# EAGLE design PosilaciSystemy (EAGLE 5.06)
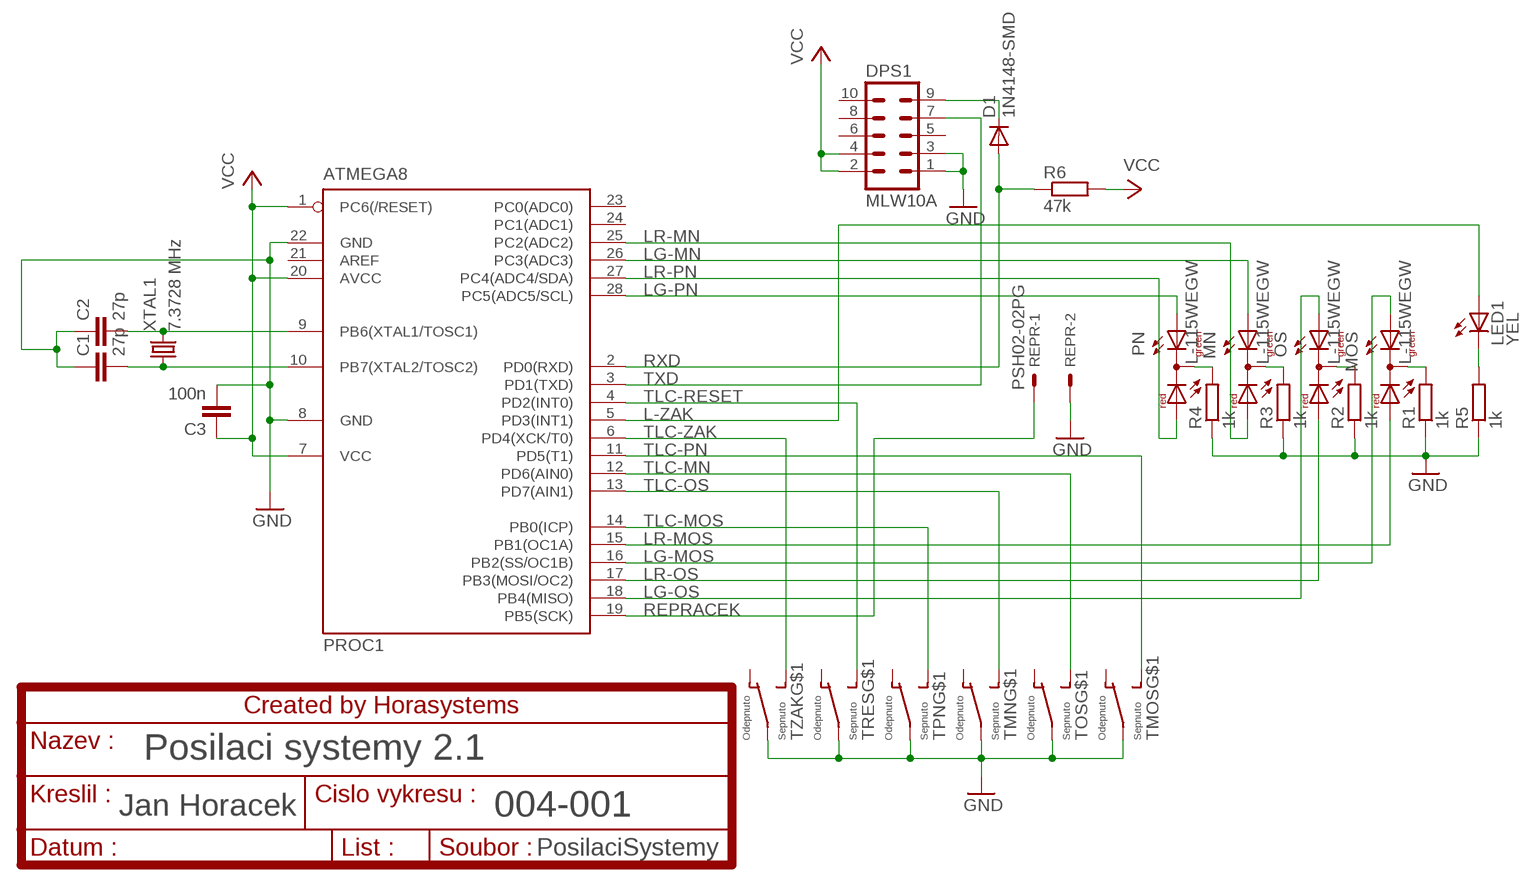
[diagram p0: schematic, sheet 1]

## Parts
C1  27p  C-EUC0805  [C0805]
C2  27p  C-EUC0805  [C0805]
C3  100n  C-EUC1206  [C1206]
D1  1N4148-SMD  1N4148-1206  [R1206]
DPS1  MLW10A  ML10L  [ML10L]
LED1  YEL  LED3MM  [LED3MM]
MN  L-115WEGW  DUOLED-RG-C  [DUOLED-C-5MM]
MOS  L-115WEGW  DUOLED-RG-C  [DUOLED-C-5MM]
OS  L-115WEGW  DUOLED-RG-C  [DUOLED-C-5MM]
PN  L-115WEGW  DUOLED-RG-C  [DUOLED-C-5MM]
PROC1  ATMEGA8  MEGA8-P  [DIL28-3]
R1  1k  R-EU_R1206  [R1206]
R2  1k  R-EU_R1206  [R1206]
R3  1k  R-EU_R1206  [R1206]
R4  1k  R-EU_R1206  [R1206]
R5  1k  R-EU_R1206  [R1206]
R6  47k  R-EU_R1206  [R1206]
REPR  PSH02-02PG  22-05-7028-02  [7395-02]
TMN  P-B170H  HORASPINAC  [HORASPINAC]
TMOS  P-B170H  HORASPINAC  [HORASPINAC]
TOS  P-B170H  HORASPINAC  [HORASPINAC]
TPN  P-B170H  HORASPINAC  [HORASPINAC]
TRES  P-B170H  HORASPINAC  [HORASPINAC]
TZAK  P-B170H  HORASPINAC  [HORASPINAC]
XTAL1  7.3728 MHz  CRYSTALHC49S  [HC49/S]

## Nets
GND: C1.1 C2.1 C3.2 DPS1.1 DPS1.3 PROC1.8(GND) PROC1.22(GND) R1.1 R2.1 R3.1 R4.1 R5.1 REPR.2 TMN.NAPAJENI1(NAPAJENI) TMOS.NAPAJENI1(NAPAJENI) TOS.NAPAJENI1(NAPAJENI) TPN.NAPAJENI1(NAPAJENI) TRES.NAPAJENI1(NAPAJENI) TZAK.NAPAJENI1(NAPAJENI)
L1: MOS.C R1.2
L2: OS.C R2.2
L3: MN.C R3.2
L4: PN.C R4.2
L-ZAK: LED1.A PROC1.5(PD3(INT1))
LG-MN: MN.AX(AG) PROC1.26(PC3(ADC3))
LG-MOS: MOS.AX(AG) PROC1.16(PB2(SS/OC1B))
LG-OS: OS.AX(AG) PROC1.18(PB4(MISO))
LG-PN: PN.AX(AG) PROC1.28(PC5(ADC5/SCL))
LR-MN: MN.AR PROC1.25(PC2(ADC2))
LR-MOS: MOS.AR PROC1.15(PB1(OC1A))
LR-OS: OS.AR PROC1.17(PB3(MOSI/OC2))
LR-PN: PN.AR PROC1.27(PC4(ADC4/SDA))
N$5: LED1.K(C) R5.2
REPRACEK: PROC1.19(PB5(SCK)) REPR.1
RXD: D1.A PROC1.2(PD0(RXD)) R6.1
RXD_: D1.K(C) DPS1.9
TLC-MN: PROC1.12(PD6(AIN0)) TOS.SEPNUTO1(SEPNUTO)
TLC-MOS: PROC1.14(PB0(ICP)) TPN.SEPNUTO1(SEPNUTO)
TLC-OS: PROC1.13(PD7(AIN1)) TMN.SEPNUTO1(SEPNUTO)
TLC-PN: PROC1.11(PD5(T1)) TMOS.SEPNUTO1(SEPNUTO)
TLC-RESET: PROC1.4(PD2(INT0)) TRES.SEPNUTO1(SEPNUTO)
TLC-ZAK: PROC1.6(PD4(XCK/T0)) TZAK.SEPNUTO1(SEPNUTO)
TXD: DPS1.7 PROC1.3(PD1(TXD))
VCC: C3.1 DPS1.2 DPS1.4 PROC1.1(PC6(/RESET)) PROC1.7(VCC) PROC1.20(AVCC) R6.2
XTAL1: C2.2 PROC1.9(PB6(XTAL1/TOSC1)) XTAL1.2
XTAL2: C1.2 PROC1.10(PB7(XTAL2/TOSC2)) XTAL1.1
Unconnected: DPS1.5 DPS1.6 DPS1.8 DPS1.10 PROC1.21(AREF) PROC1.23(PC0(ADC0)) PROC1.24(PC1(ADC1)) TMN.NAPAJENI2(NAPAJENI) TMN.ODEPNUTO1(ODEPNUTO) TMN.ODEPNUTO2(ODEPNUTO) TMN.SEPNUTO2(SEPNUTO) TMOS.NAPAJENI2(NAPAJENI) TMOS.ODEPNUTO1(ODEPNUTO) TMOS.ODEPNUTO2(ODEPNUTO) TMOS.SEPNUTO2(SEPNUTO) TOS.NAPAJENI2(NAPAJENI) TOS.ODEPNUTO1(ODEPNUTO) TOS.ODEPNUTO2(ODEPNUTO) TOS.SEPNUTO2(SEPNUTO) TPN.NAPAJENI2(NAPAJENI) TPN.ODEPNUTO1(ODEPNUTO) TPN.ODEPNUTO2(ODEPNUTO) TPN.SEPNUTO2(SEPNUTO) TRES.NAPAJENI2(NAPAJENI) TRES.ODEPNUTO1(ODEPNUTO) TRES.ODEPNUTO2(ODEPNUTO) TRES.SEPNUTO2(SEPNUTO) TZAK.NAPAJENI2(NAPAJENI) TZAK.ODEPNUTO1(ODEPNUTO) TZAK.ODEPNUTO2(ODEPNUTO) TZAK.SEPNUTO2(SEPNUTO)

## Notes on the sheet
- Posilaci systemy 2.1
- 004-001

## Library data of the parts
C1-C3 = rcl:C-EU: CAPACITOR, European symbol
D1 = diode:1N4148: DIODE high speed (Philips)
DPS1 = con-ml:ML10L: HARTING
LED1 = led:LED: LED OSRAM: - CHIPLED LG R971, LG N971, LY N971, LG Q971, LY Q971, LO R971, LY R971 LH N974, LH R974 LS Q976, LO Q976, LY Q976 LO Q996 - Hyper CHIPLED LW Q18S LB Q993, LB Q99A, LB R99A - SideLED LS A670, LO A670, LY A670, LG A670, LP A670 LB A673, LV A673, LT A673, LW A673 LH A674 LY A675 LS A676, LA A676, LO A676, LY A676, LW A676 LS A679, LY A679, LG A679 - Hyper Micro SIDELED® LS Y876, LA Y876, LO Y876, LY Y876 LT Y87S - SmartLED LW L88C, LW L88S LB L89C, LB L89S, LG L890 LS L89K, LO L89K, LY L89K LS L896, LA L896, LO L896, LY L896 - TOPLED LS T670, LO T670, LY T670, LG T670, LP T670 LSG T670, LSP T670, LSY T670, LOP T670, LYG T670 LG T671, LOG T671, LSG T671 LB T673, LV T673, LT T673, LW T673 LH T674 LS T676, LA T676, LO T676, LY T676, LB T676, LH T676, LSB T676, LW T676 LB T67C, LV T67C, LT T67C, LS T67K, LO T67K, LY T67K, LW E67C LS E67B, LA E67B, LO E67B, LY E67B, LB E67C, LV E67C, LT E67C LW T67C LS T679, LY T679, LG T679 LS T770, LO T770, LY T770, LG T770, LP T770 LB T773, LV T773, LT T773, LW T773 LH T774 LS E675, LA E675, LY E675, LS T675 LS T776, LA T776, LO T776, LY T776, LB T776 LHGB T686 LT T68C, LB T68C - Hyper Mini TOPLED® LB M676 - Mini TOPLED Santana® LG M470 LS M47K, LO M47K, LY M47K Source: http://www.osram.convergy.de LUXEON: - LUMILED® LXK2-PW12-R00, LXK2-PW12-S00, LXK2-PW14-U00, LXK2-PW14-V00 LXK2-PM12-R00, LXK2-PM12-S00, LXK2-PM14-U00 LXK2-PE12-Q00, LXK2-PE12-R00, LXK2-PE12-S00, LXK2-PE14-T00, LXK2-PE14-U00 LXK2-PB12-K00, LXK2-PB12-L00, LXK2-PB12-M00, LXK2-PB14-N00, LXK2-PB14-P00, LXK2-PB14-Q00 LXK2-PR12-L00, LXK2-PR12-M00, LXK2-PR14-Q00, LXK2-PR14-R00 LXK2-PD12-Q00, LXK2-PD12-R00, LXK2-PD12-S00 LXK2-PH12-R00, LXK2-PH12-S00 LXK2-PL12-P00, LXK2-PL12-Q00, LXK2-PL12-R00 Source: www.luxeon.com KINGBRIGHT: KA-3528ASYC Source: www.kingbright.com
MN MOS OS PN = led:DUOLED-RG-C: DUO LED 2 colors (red/green), 5 mm, round, common Cathode www.ligitek.com or other producers.
PROC1 = atmel:MEGA8-P: MICROCONTROLLER 8 Kbytes FLASH, 1 kbytes SRAM, 512 bytes EEPROM, USART, 4-channel 10 bit ADC, 2-channel 8 bit ADC Pin compatible with Atmega48, ATMega88, ATMega168 Source: avr.lbr
R1-R6 = rcl:R-EU_: RESISTOR, European symbol
REPR = con-molex:22-?-02: CONNECTOR wire to board 2.54 mm (.1 inch) pitch header
TMN TMOS TOS TPN TRES TZAK = switch:HORASPINAC
XTAL1 = crystal:CRYSTAL: CRYSTAL

## Board
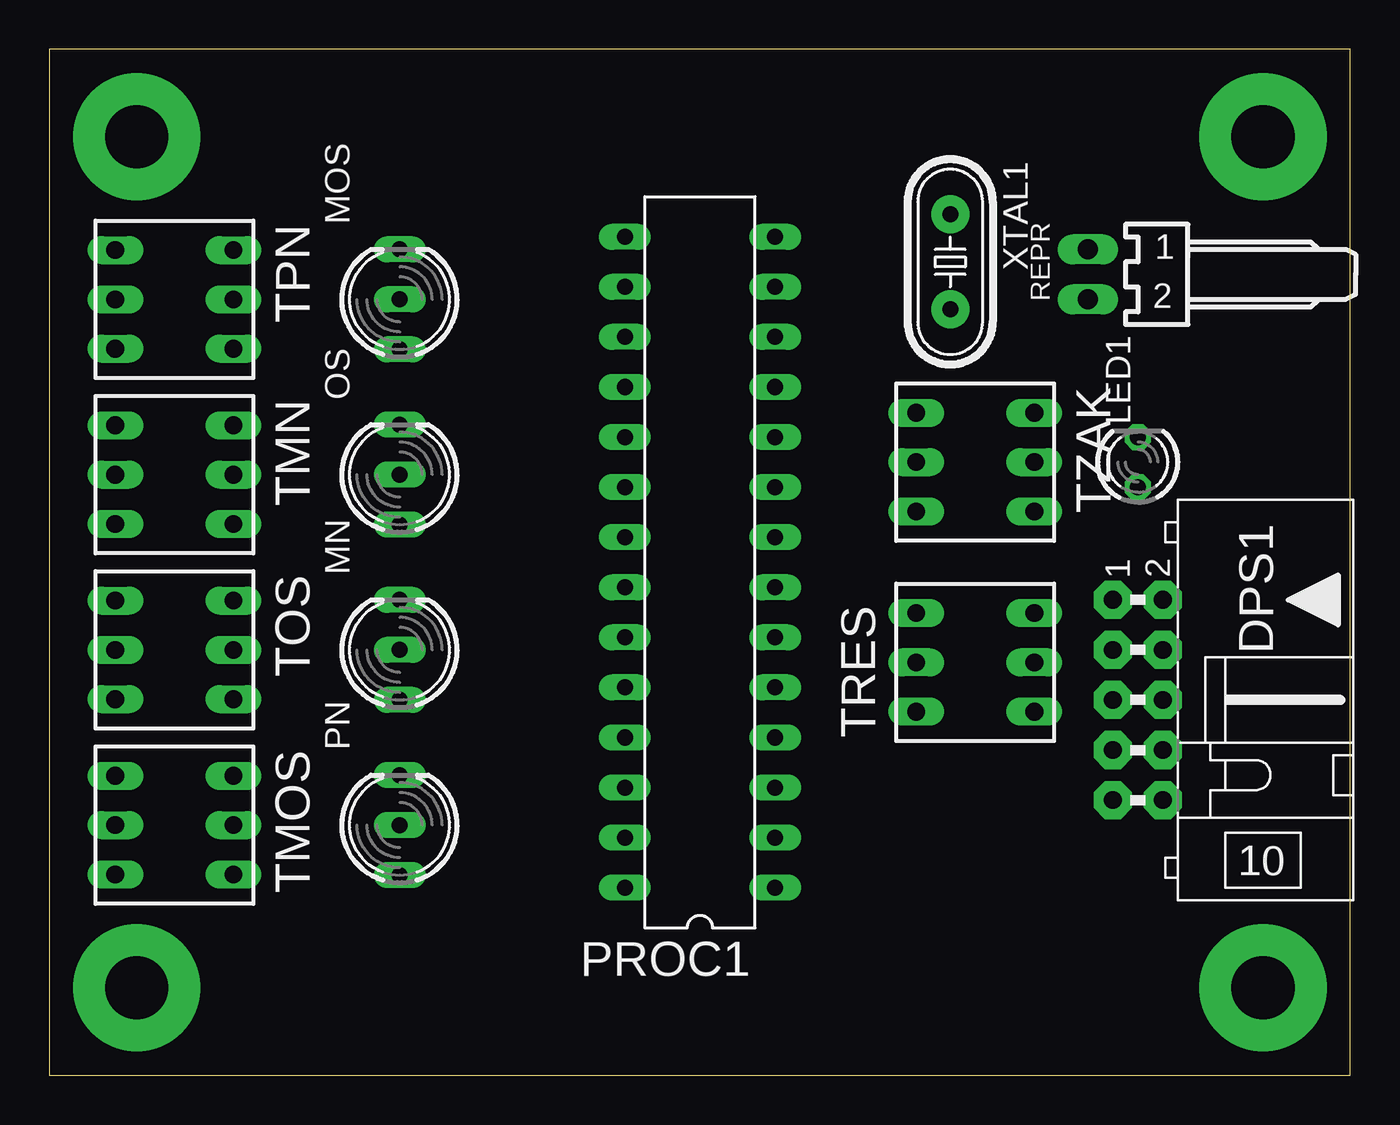
[diagram p1: board, top side]
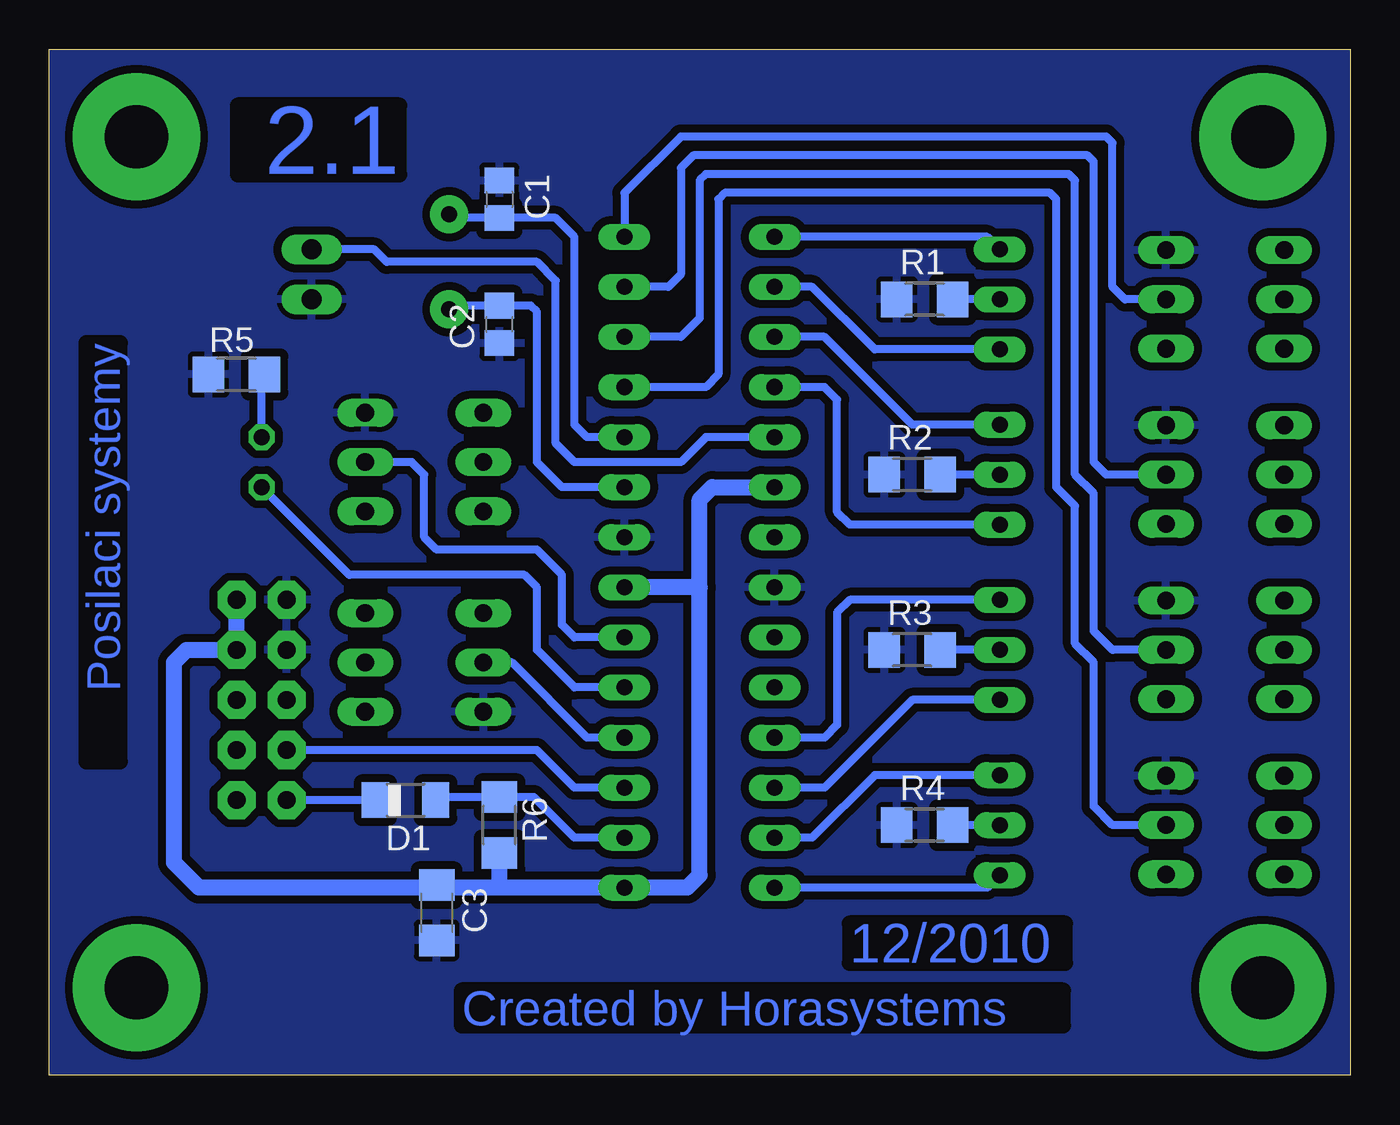
[diagram p2: board, bottom side, seen from below]

Size 66.02 x 52.06 mm. Coordinates in mm from the lower left corner, seen from the top.
Outline: 0,0 66.02,0 66.02,52.06 0,52.06 0,0
Copper layers (1*16): Top 0.035mm / dielectric 1.5mm / Bottom 0.035mm
Design rules "default *": minimum track width 10mil, minimum drill 24mil, track to track 0.4mm, track to pad 0.4mm, pad to pad 0.4mm, via to via 0.4mm, smd to smd 0.4mm, copper to edge 1mil, drill to drill 8mil, minimum pad ring 10mil, minimum via ring 8mil, stop-mask expansion 4mil, vias tented up to drill 0mil, thermal gap 10mil

### Footprints (pad centres in the part's own frame; a part is rotated, then mirrored left to right if it is on the bottom)
C0805 = smd 1.3 x 1.5: 1 -0.95,0; 2 0.95,0
C1206 = smd 1.6 x 1.8: 1 -1.4,0; 2 1.4,0
R1206 = smd 1.375 x 1.8: A -1.53,0; K 1.53,0
ML10L = drill 0.9 pad 1.93 octagon: 1 -5.08,-1.27; 2 -5.08,1.27; 3 -2.54,-1.27; 4 -2.54,1.27; 5 0,-1.27; 6 0,1.27; 7 2.54,-1.27; 8 2.54,1.27; 9 5.08,-1.27; 10 5.08,1.27
LED3MM = drill 0.813 octagon: A -1.27,0; K 1.27,0
DUOLED-C-5MM = drill 0.813 long: AR 2.54,0; AX -2.54,0; C 0,0
DIL28-3 = drill 0.813 long: 1 -16.51,-3.81; 2 -13.97,-3.81; 3 -11.43,-3.81; 4 -8.89,-3.81; 5 -6.35,-3.81; 6 -3.81,-3.81; 7 -1.27,-3.81; 8 1.27,-3.81; 9 3.81,-3.81; 10 6.35,-3.81; 11 8.89,-3.81; 12 11.43,-3.81; 13 13.97,-3.81; 14 16.51,-3.81; 15 16.51,3.81; 16 13.97,3.81; 17 11.43,3.81; 18 8.89,3.81; 19 6.35,3.81; 20 3.81,3.81; 21 1.27,3.81; 22 -1.27,3.81; 23 -3.81,3.81; 24 -6.35,3.81; 25 -8.89,3.81; 26 -11.43,3.81; 27 -13.97,3.81; 28 -16.51,3.81
R1206' = smd 1.6 x 1.803: 1 -1.422,0; 2 1.422,0
7395-02 = drill 1.016 long: 1 1.27,0; 2 -1.27,0
HORASPINAC = drill 0.9 pad 1.422 long: NAPAJENI1 -2.5,3; NAPAJENI2 2.5,-3; ODEPNUTO1 2.5,3; ODEPNUTO2 -2.5,-3; SEPNUTO1 0,3; SEPNUTO2 0,-3
HC49/S = drill 0.813 pad 1.93 round: 1 -2.413,0; 2 2.413,0

### Placement (x,y rotation side)
C1  43.18,44.45 270 bottom
C2  43.18,38.1 90 bottom
C3  46.35,8.26 270 bottom
D1  47.94,13.97 180 bottom
DPS1  55.24,19.05 270 top
LED1  55.24,31.11 90 top
MN  17.78,21.59 90 top
MOS  17.78,39.37 90 top
OS  17.78,30.48 90 top
PN  17.78,12.7 90 top
PROC1  33.02,26.04 90 top
R1  1k  [R1206']  21.59,39.37 0 bottom
R2  1k  [R1206']  22.23,30.48 0 bottom
R3  1k  [R1206']  22.23,21.59 0 bottom
R4  1k  [R1206']  21.59,12.7 0 bottom
R5  1k  [R1206']  56.52,35.56 0 bottom
R6  47k  [R1206']  43.18,12.7 270 bottom
REPR  52.7,40.64 90 top
TMN  6.35,30.48 270 top
TMOS  6.35,12.7 270 top
TOS  6.35,21.59 270 top
TPN  6.35,39.37 270 top
TRES  46.99,20.95 90 top
TZAK  46.99,31.11 270 top
XTAL1  45.72,41.27 270 top

### Tracks (layer width: path | path; a pad name or v marks a point on that pad's centre or on a via)
GND
  pour Bottom: 0,0 0,52.07 66.04,52.07 66.04,0
L1
  Bottom 0.406: MOS.C R1.2
L2
  Bottom 0.406: OS.C R2.2
L3
  Bottom 0.406: MN.C R3.2
L4
  Bottom 0.406: PN.C R4.2
L-ZAK
  Bottom 0.406: PROC1.5 39.37,19.68 41.27,21.59 41.27,24.77 41.91,25.4 50.8,25.4 LED1.A
LG-MN
  Bottom 0.406: MN.AX 22.23,19.05 26.67,14.61 PROC1.26
LG-MOS
  Bottom 0.406: MOS.AX 24.13,36.83 27.3,40.01 PROC1.16
LG-OS
  Bottom 0.406: PROC1.18 26.67,34.92 26.04,34.29 26.04,28.57 25.4,27.94 OS.AX
LG-PN
  Bottom 0.406: PROC1.28 18.41,9.53 PN.AX
LR-MN
  Bottom 0.406: PROC1.25 26.67,17.14 26.04,17.78 26.04,23.5 25.4,24.13 MN.AR
LR-MOS
  Bottom 0.406: PROC1.15 18.41,42.55 MOS.AR
LR-OS
  Bottom 0.406: OS.AR 22.23,33.02 26.67,37.47 PROC1.17
LR-PN
  Bottom 0.406: PN.AR 24.13,15.24 27.3,12.06 PROC1.27
N$1  (via drill 3.2 pad 6.45)
  other vias: 4.45,4.45
N$2  (via drill 3.2 pad 6.45)
  other vias: 4.45,47.62
N$3  (via drill 3.2 pad 6.45)
  other vias: 61.59,47.62
N$4  (via drill 3.2 pad 6.45)
  other vias: 61.59,4.45
N$5
  Bottom 0.406: LED1.K 55.24,35.41 R5.2
REPRACEK
  Bottom 0.406: REPR.1 49.53,41.91 48.9,41.27 41.27,41.27 40.32,40.32 40.32,32.07 39.37,31.11 33.97,31.11 32.7,32.38 PROC1.19
RXD
  Bottom 0.406: PROC1.2 39.37,12.06 41.43,14.12 R6.1 46.26,14.12 D1.A
RXD_
  Bottom 0.406: D1.K DPS1.9
TLC-MN
  Bottom 0.406: PROC1.12 33.97,37.47 33.02,38.42 33.02,45.4 32.7,45.72 14.29,45.72 13.97,45.4 13.97,30.48 13.02,29.53 13.02,22.54 12.06,21.59 TOS.SEPNUTO1
TLC-MOS
  Bottom 0.406: PROC1.14 36.83,44.77 33.97,47.62 12.38,47.62 12.06,47.31 12.06,40.01 11.43,39.37 TPN.SEPNUTO1
TLC-OS
  Bottom 0.406: PROC1.13 34.61,40.01 33.97,40.64 33.97,46.04 33.34,46.67 13.34,46.67 13.02,46.35 13.02,31.11 12.38,30.48 TMN.SEPNUTO1
TLC-PN
  Bottom 0.406: PROC1.11 32.7,34.92 32.07,35.56 32.07,44.45 31.75,44.77 15.24,44.77 14.92,44.45 14.92,29.84 13.97,28.89 13.97,21.91 13.02,20.95 13.02,13.65 12.06,12.7 TMOS.SEPNUTO1
TLC-RESET
  Bottom 0.406: TRES.SEPNUTO1 42.55,20.95 38.73,17.14 PROC1.4
TLC-ZAK
  Bottom 0.406: PROC1.6 39.37,22.23 40.01,22.86 40.01,25.4 41.27,26.67 46.35,26.67 46.99,27.3 46.99,30.48 47.62,31.11 TZAK.SEPNUTO1
TXD
  Bottom 0.406: PROC1.3 39.37,14.61 41.27,16.51 DPS1.7
VCC
  Bottom 0.813: 43.18,9.53 PROC1.1 33.66,9.53 33.02,10.16 33.02,24.77 | 43.18,9.53 46.23,9.53 C3.1 46.48,9.53 58.42,9.53 59.69,10.79 59.69,20.95 59.05,21.59 DPS1.4 DPS1.2 | 33.02,24.77 PROC1.7 | 43.18,9.53 R6.2 | PROC1.20 32.38,29.84 33.02,29.21 33.02,24.77
XTAL1
  Bottom 0.406: XTAL1.2 45.53,39.05 C2.2 41.59,39.05 41.27,38.73 41.27,31.11 40.01,29.84 PROC1.9
XTAL2
  Bottom 0.406: PROC1.10 38.73,32.38 39.37,33.02 39.37,42.55 40.33,43.5 C1.2 45.53,43.5 XTAL1.1

### Text on the board
Bottom: 2.1 | Posilaci systemy | 12/2010 | Created by Horasystems
Popisky: 7 | MOs | 7 | 7 | ZAK | Os | 7 | 7 | Mn | Zrusit | 7 | Pn